# EAGLE design RAB FM Birds 3 for open bus (EAGLE 9.5.2)
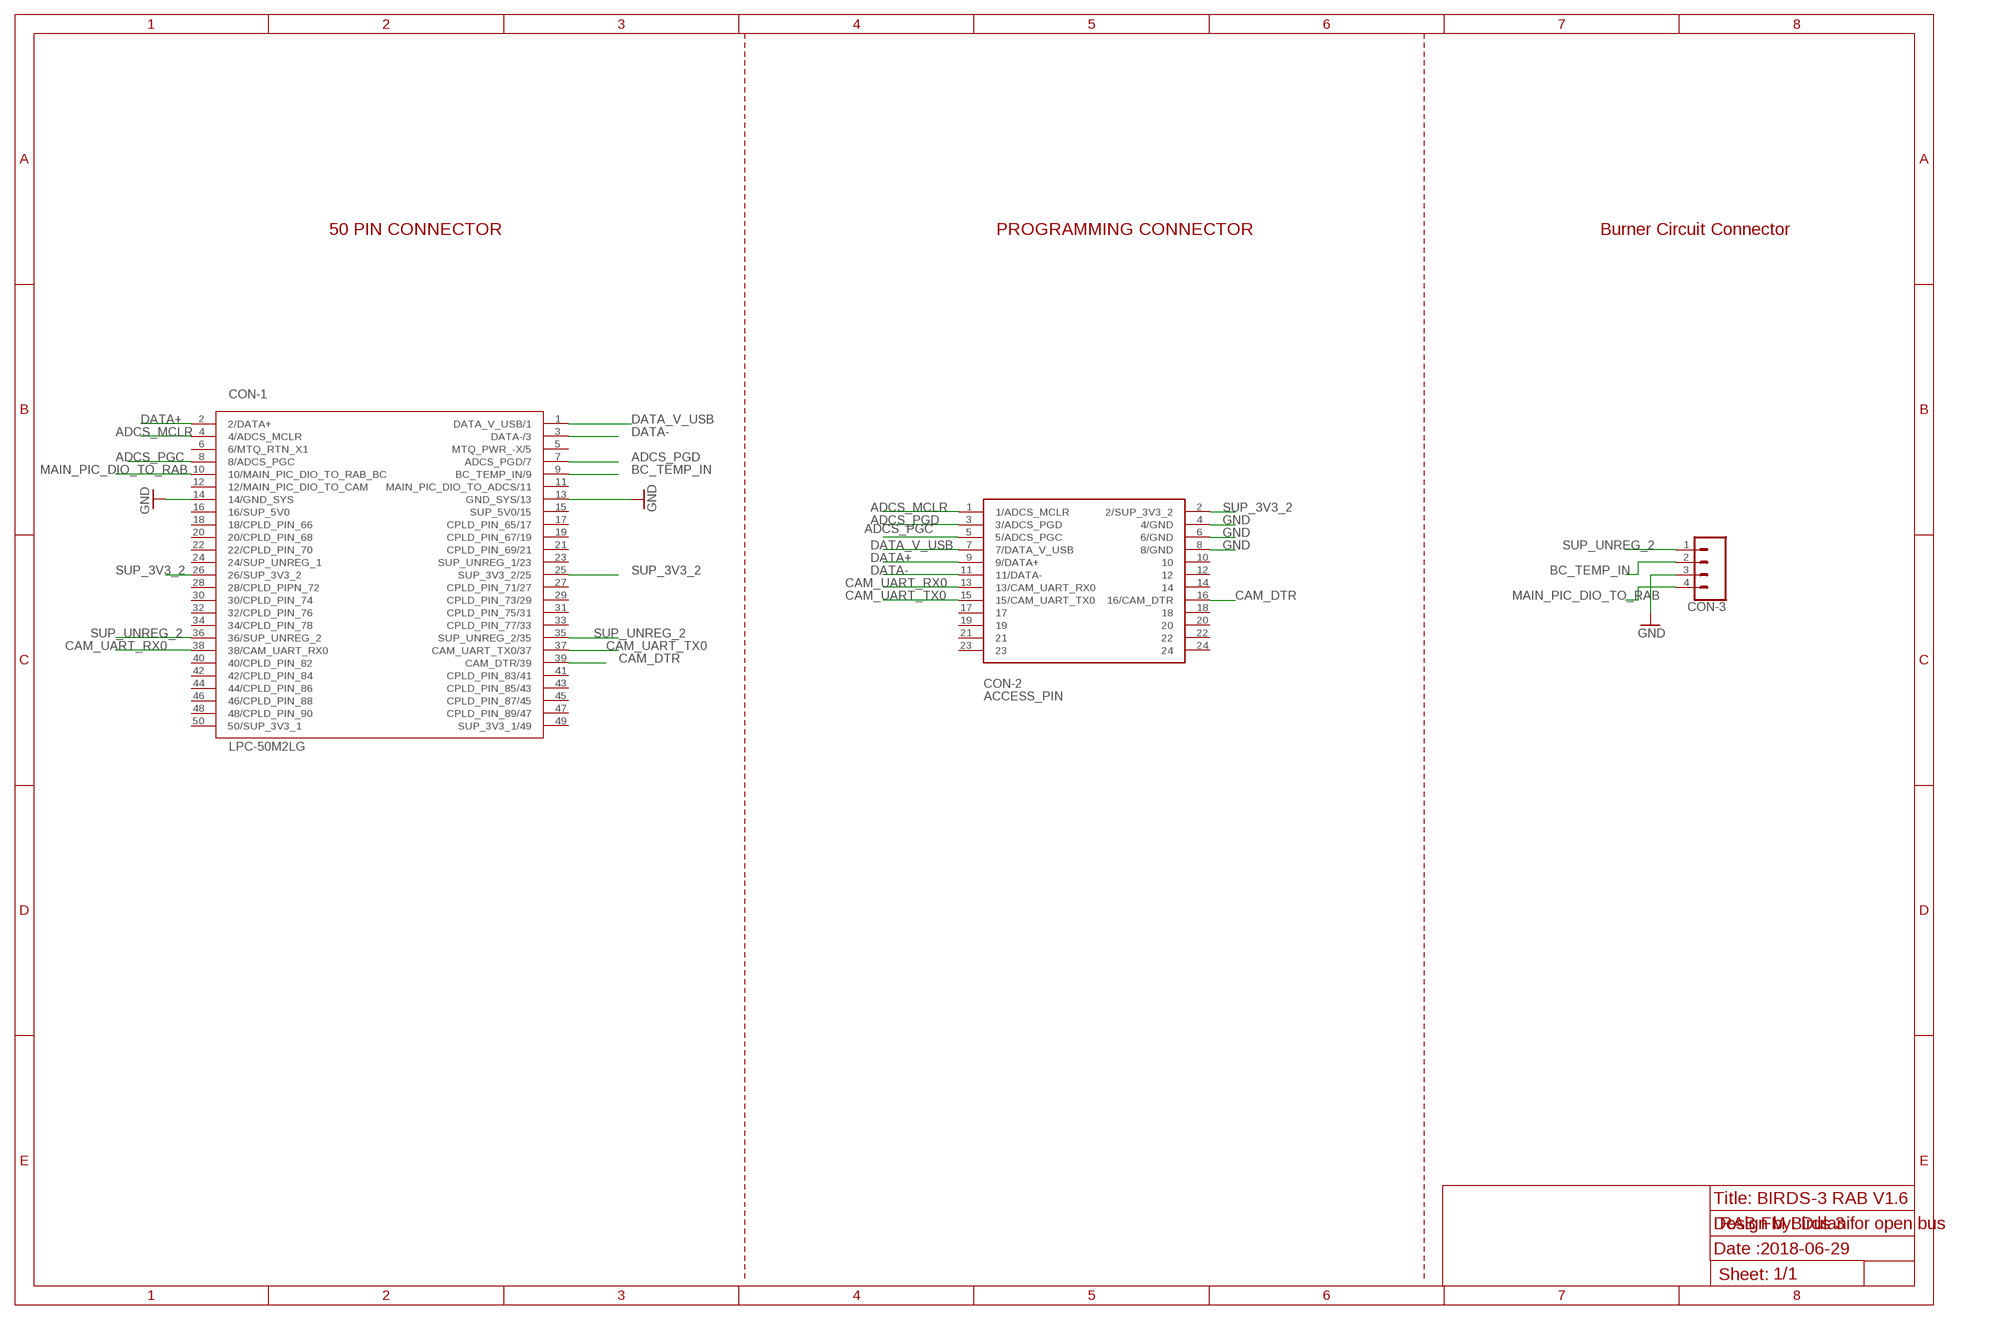
[diagram p0: schematic, sheet 1]

## Parts
CON-1  LPC-50M2LG  [LPC-50M2LG]
CON-2  ACCESS_PIN  [SMD24]
CON-3  CONN_04JST-PTH  [JST-4-PTH]

## Nets
ADCS_MCLR: CON-1.4(4/ADCS_MCLR) CON-2.1(1/ADCS_MCLR)
ADCS_PGC: CON-1.8(8/ADCS_PGC) CON-2.5(5/ADCS_PGC)
ADCS_PGD: CON-1.7(ADCS_PGD/7) CON-2.3(3/ADCS_PGD)
BC_TEMP_IN: CON-1.9(BC_TEMP_IN/9) CON-3.2
CAM_DTR: CON-1.39(CAM_DTR/39) CON-2.16(16/CAM_DTR)
CAM_UART_RX0: CON-1.38(38/CAM_UART_RX0) CON-2.13(13/CAM_UART_RX0)
CAM_UART_TX0: CON-1.37(CAM_UART_TX0/37) CON-2.15(15/CAM_UART_TX0)
DATA+: CON-1.2(2/DATA+) CON-2.9(9/DATA+)
DATA-: CON-1.3(DATA-/3) CON-2.11(11/DATA-)
DATA_V_USB: CON-1.1(DATA_V_USB/1) CON-2.7(7/DATA_V_USB)
GND: CON-1.13(GND_SYS/13) CON-1.14(14/GND_SYS) CON-2.4(4/GND) CON-2.6(6/GND) CON-2.8(8/GND) CON-3.3
MAIN_PIC_DIO_TO_RAB: CON-1.10(10/MAIN_PIC_DIO_TO_RAB_BC) CON-3.4
SUP_3V3_2: CON-1.25(SUP_3V3_2/25) CON-1.26(26/SUP_3V3_2) CON-2.2(2/SUP_3V3_2)
SUP_UNREG_2: CON-1.35(SUP_UNREG_2/35) CON-1.36(36/SUP_UNREG_2) CON-3.1
Unconnected: CON-1.5(MTQ_PWR_-X/5) CON-1.6(6/MTQ_RTN_X1) CON-1.11(MAIN_PIC_DIO_TO_ADCS/11) CON-1.12(12/MAIN_PIC_DIO_TO_CAM) CON-1.15(SUP_5V0/15) CON-1.16(16/SUP_5V0) CON-1.17(CPLD_PIN_65/17) CON-1.18(18/CPLD_PIN_66) CON-1.19(CPLD_PIN_67/19) CON-1.20(20/CPLD_PIN_68) CON-1.21(CPLD_PIN_69/21) CON-1.22(22/CPLD_PIN_70) CON-1.23(SUP_UNREG_1/23) CON-1.24(24/SUP_UNREG_1) CON-1.27(CPLD_PIN_71/27) CON-1.28(28/CPLD_PIPN_72) CON-1.29(CPLD_PIN_73/29) CON-1.30(30/CPLD_PIN_74) CON-1.31(CPLD_PIN_75/31) CON-1.32(32/CPLD_PIN_76) CON-1.33(CPLD_PIN_77/33) CON-1.34(34/CPLD_PIN_78) CON-1.40(40/CPLD_PIN_82) CON-1.41(CPLD_PIN_83/41) CON-1.42(42/CPLD_PIN_84) CON-1.43(CPLD_PIN_85/43) CON-1.44(44/CPLD_PIN_86) CON-1.45(CPLD_PIN_87/45) CON-1.46(46/CPLD_PIN_88) CON-1.47(CPLD_PIN_89/47) CON-1.48(48/CPLD_PIN_90) CON-1.49(SUP_3V3_1/49) CON-1.50(50/SUP_3V3_1) CON-2.10 CON-2.12 CON-2.14 CON-2.17 CON-2.18 CON-2.19 CON-2.20 CON-2.21 CON-2.22 CON-2.23 CON-2.24

## Notes on the sheet
- 50 PIN CONNECTOR | PROGRAMMING CONNECTOR | Burner Circuit Connector
- Title: BIRDS-3 RAB V1.6
- Design by: Dulani
- Date :2018-06-29

## Library data of the parts
CON-1 = BIRDS3_Tha_lib:LPC-50M2LG
CON-2 = Access_pin:ACCESS_PIN
CON-3 = SparkFun-Connectors:CONN_04: Multi connection point. Often used as Generic Header-pin footprint for 0.1 inch spaced/style header connections On any of the 0.1 inch spaced packages, you can populate with these: Break Away Headers - Straight <https://www.sparkfun.com/products/116> (PRT-00116) Break Away Male Headers - Right Angle <https://www.sparkfun.com/products/553> (PRT-00553) Female Headers <https://www.sparkfun.com/products/115> (PRT-00115) Break Away Headers - Machine Pin <https://www.sparkfun.com/products/117> (PRT-00117) Break Away Female Headers - Swiss Machine Pin <https://www.sparkfun.com/products/743> (PRT-00743) For SCREWTERMINALS and SPRING TERMINALS visit here: Screw Terimnals on SparkFun.com <https://www.sparkfun.com/search/results?term=Screw+Terminals> (5mm/3.5mm/2.54mm spacing) This device is also useful as a general connection point to wire up your design to another part of your project. Our various solder wires solder well into these plated through hole pads. Hook-Up Wire - Assortment (Stranded, 22 AWG) <https://www.sparkfun.com/products/11375> (PRT-11375) Hook-Up Wire - Assortment (Solid Core, 22 AWG) <https://www.sparkfun.com/products/11367> (PRT-11367) View the entire wire category on our website here <https://www.sparkfun.com/categories/141> Special notes: Molex polarized connector foot print use with SKU : PRT-08231 with associated crimp pins and housings. 1MM SMD Version SKU: PRT-10208; PROD_ID: WIRE-13531; SF_ID: PRT-09916

## Board
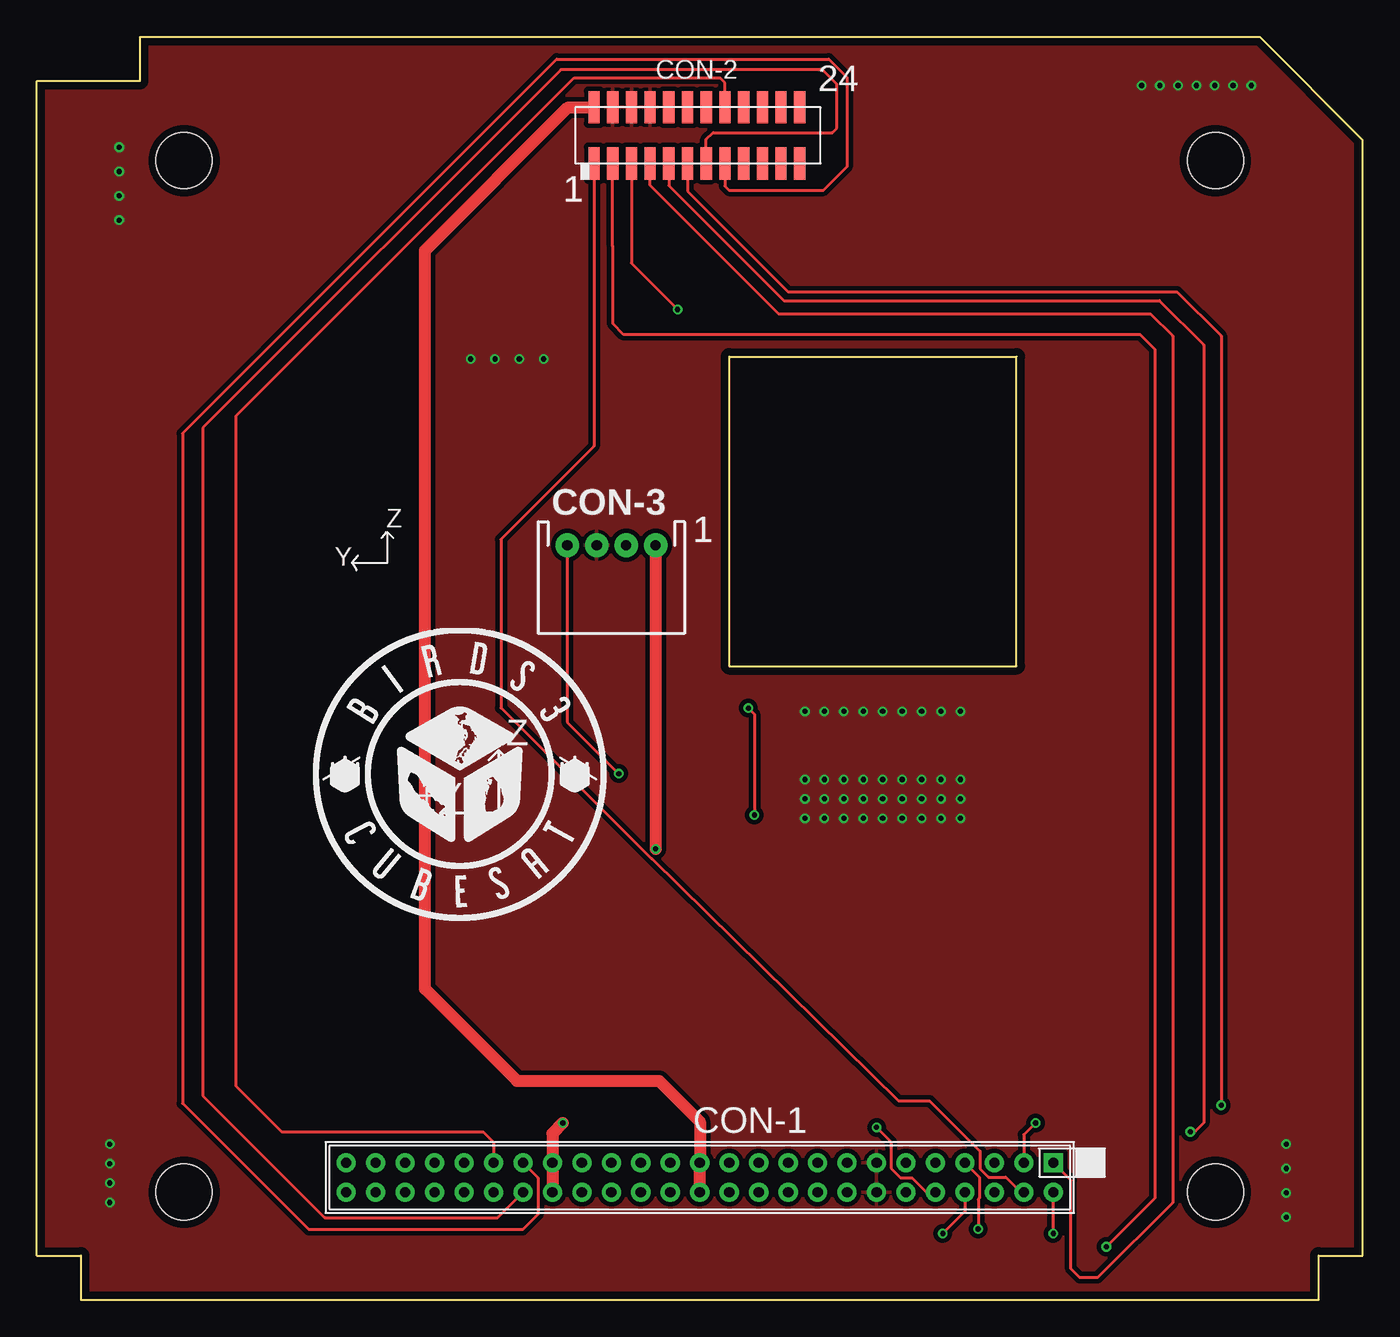
[diagram p1: board, top side]
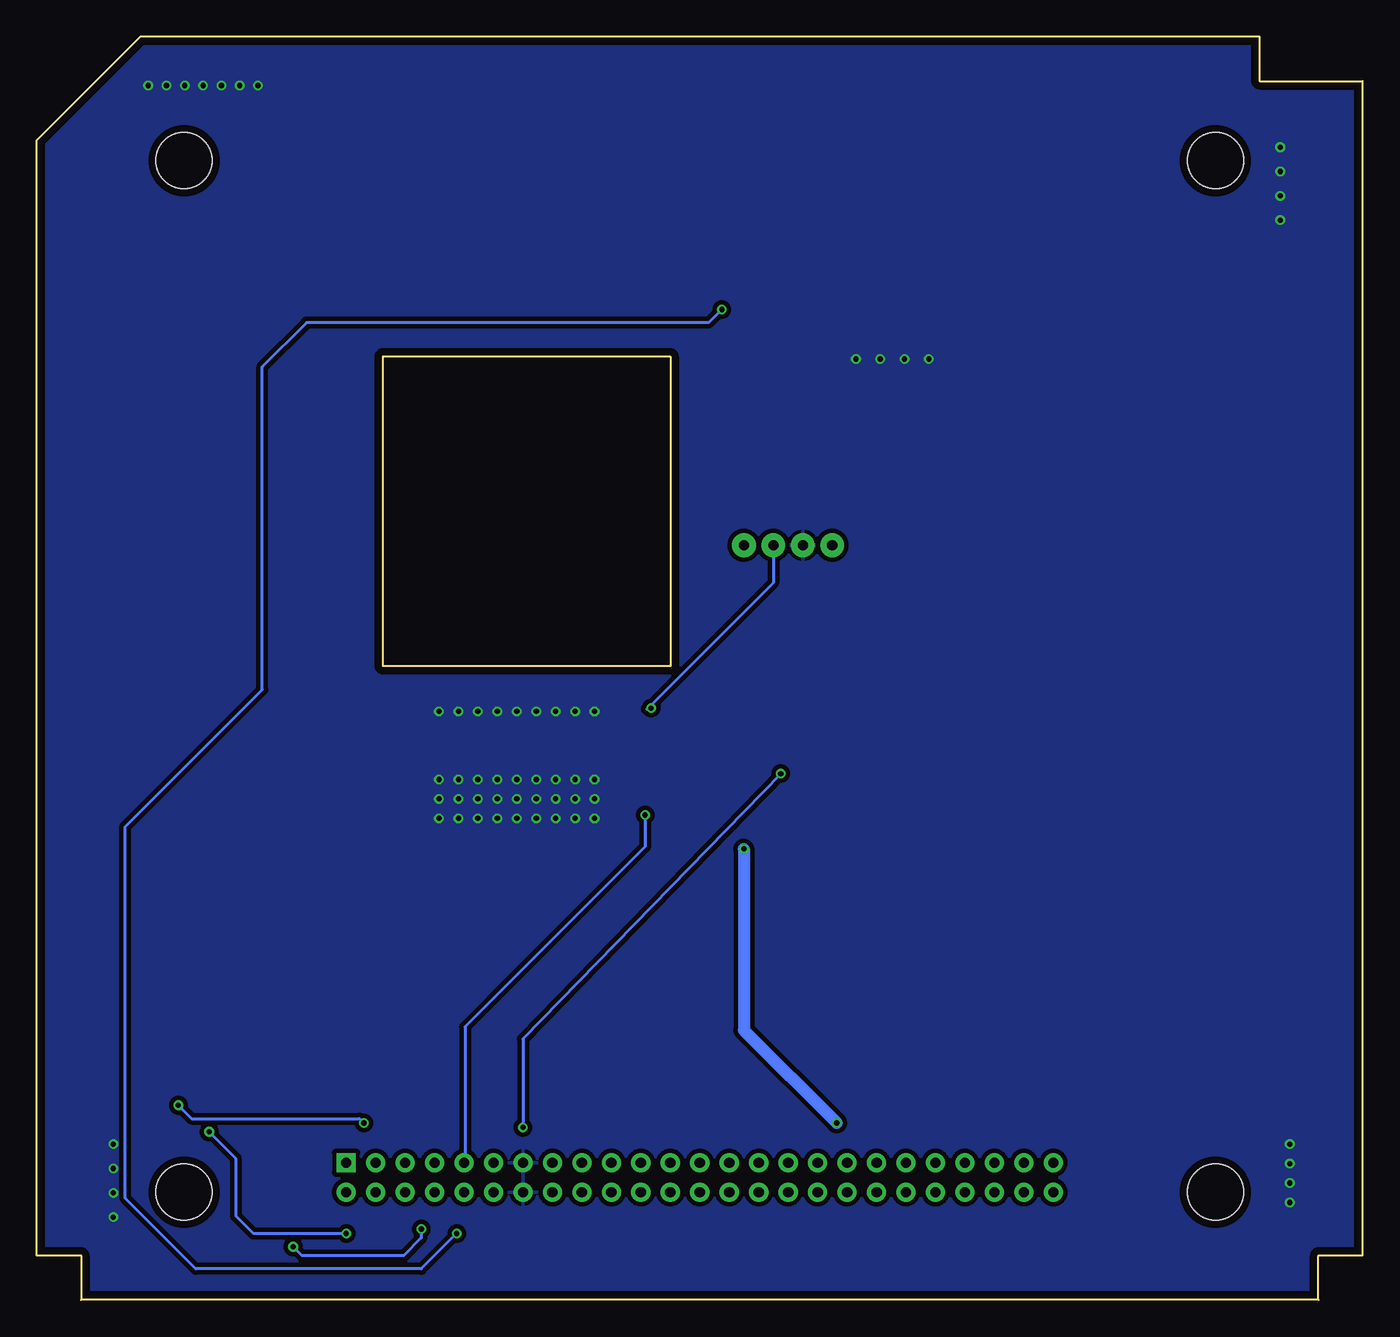
[diagram p2: board, bottom side, seen from below]

Size 90 x 85.7 mm. Coordinates in mm from the lower left corner, seen from the top.
Outline: 3,0 87,0 87,3 90,3 90,78.7 83,85.7 7,85.7 7,82.7 0,82.7 0,3 3,3 3,0
Outline: 47,64 66.5,64 66.5,43 47,43 47,64
Copper layers (1+2*15+16): Top 0.018mm / dielectric 0.25mm / Route2 0.035mm / dielectric 1mm / Route15 0.035mm / dielectric 0.25mm / Bottom 0.018mm
Design rules "pban_5mil-l4": minimum track width 5mil, minimum drill 0.3mm, track to track 5mil, track to pad 0.229mm, pad to pad 5mil, via to via 5mil, smd to smd 5mil, copper to edge 0.5mm, drill to drill 0.5mm, minimum pad ring 0.15mm, minimum via ring 0.15mm, stop-mask expansion 4mil, vias tented up to drill 0.35mm, thermal gap 10mil
Holes 3.8 mm at 10,7.3 80,7.3 10,77.3 80,77.3

### Footprints (pad centres in the part's own frame; a part is rotated, then mirrored left to right if it is on the bottom)
LPC-50M2LG = drill 0.7 pad 1.3 square: 1 0,2 | drill 0.7 pad 1.3: 2 0,0; 3 2,2; 4 2,0; 5 4,2; 6 4,0; 7 6,2; 8 6,0; 9 8,2; 10 8,0; 11 10,2; 12 10,0; 13 12,2; 14 12,0; 15 14,2; 16 14,0; 17 16,2; 18 16,0; 19 18,2; 20 18,0; 21 20,2; 22 20,0; 23 22,2; 24 22,0; 25 24,2; 26 24,0; 27 26,2; 28 26,0; 29 28,2; 30 28,0; 31 30,2; 32 30,0; 33 32,2; 34 32,0; 35 34,2; 36 34,0; 37 36,2; 38 36,0; 39 38,2; 40 38,0; 41 40,2; 42 40,0; 43 42,2; 44 42,0; 45 44,2; 46 44,0; 47 46,2; 48 46,0; 49 48,2; 50 48,0
SMD24 = smd 2.2 x 0.76: 1 -3.81,-1.27; 2 0,-1.27; 3 -3.81,-2.54; 4 0,-2.54; 5 -3.81,-3.81; 6 0,-3.81; 7 -3.81,-5.08; 8 0,-5.08; 9 -3.81,-6.35; 10 0,-6.35; 11 -3.81,-7.62; 12 0,-7.62; 13 -3.81,-8.89; 14 0,-8.89; 15 -3.81,-10.16; 16 0,-10.16; 17 -3.81,-11.43; 18 0,-11.43; 19 -3.81,-12.7; 20 0,-12.7; 21 -3.81,-13.97; 22 0,-13.97; 23 -3.81,-15.24; 24 0,-15.24
JST-4-PTH = drill 0.7 pad 1.6: 1 -3,0; 2 -1,0; 3 1,0; 4 3,0

### Placement (x,y rotation side)
CON-1  69,7.3 0 bottom
CON-2  36.55,80.92 90 top
CON-3  39,51.2 180 top

### Tracks (layer width: path | path; a pad name or v marks a point on that pad's centre or on a via)
ADCS_MCLR
  Top 0.203: CON-2.1 37.82,57.92 31.5,51.6 31.5,40.17 41.73,29.94 41.76,29.94 58.5,13.5 60.6,13.5 64.02,10.08 64.02,8.89 64.59,8.32 65.78,8.32 66.8,7.3 CON-1.4
ADCS_PGC  (via drill 0.35)
  Top 0.203: CON-1.8 63,6 v61.5,4.5 | v43.5,67.2 40.36,70.34 CON-2.5 40.36,77.24
  Bottom 0.203: v61.5,4.5 63.9,2.1 79.2,2.1 84,6.9 84,32.1 74.7,41.4 74.7,63.3 71.7,66.3 44.4,66.3 v43.5,67.2
ADCS_PGD  (via drill 0.35)
  Top 0.152: 39.09,76.7 CON-2.3
  Top 0.203: v72.6,3.6 75.9,6.9 75.9,64.5 74.9,65.5 39.84,65.5 39.1,66.24 39.1,71.49 39.09,71.5 39.09,76.7 | v63.9,4.8 63.9,6.81 63.98,6.89 63.98,8.32 CON-1.7
  Bottom 0.203: v63.9,4.8 63.9,4.2 65.1,3 72,3 v72.6,3.6
BC_TEMP_IN  (via drill 0.35)
  Top 0.203: v48.3,40.15 48.71,39.74 v48.71,32.9
  Bottom 0.203: CON-3.2 40,48.66 48.58,40.08 48.37,40.08 v48.3,40.15 | v48.71,32.9 48.71,30.75 60.94,18.52 60.94,9.36 CON-1.9
CAM_DTR
  Top 0.203: CON-1.39 31,10.7 30.3,11.4 16.62,11.4 13.5,14.52 13.5,59.95 36.47,82.92 46.37,82.92 46.71,82.58 CON-2.16
CAM_UART_RX0
  Top 0.203: CON-2.13 45.44,78.74 45.9,79.2 54,79.2 54.3,79.5 54.3,82.5 53.32,83.48 35.57,83.48 11.26,59.17 11.26,13.86 19.54,5.58 31.28,5.58 CON-1.38
CAM_UART_TX0
  Top 0.203: CON-2.15 46.71,75.57 46.98,75.3 53.4,75.3 54.98,76.88 54.98,82.96 53.76,84.18 35.28,84.18 9.9,58.8 9.9,13.33 18.46,4.77 33,4.77 34.02,5.79 34.02,8.28 CON-1.37
DATA+  (via drill 0.35)
  Top 0.203: CON-2.9 42.9,75.6 50.7,67.8 76.2,67.8 79.2,64.8 79.2,12 78.6,11.4 v78.3,11.4 | v69,4.5 CON-1.2
  Bottom 0.203: v78.3,11.4 76.5,9.6 76.5,5.7 75.3,4.5 v69,4.5
DATA-  (via drill 0.35)
  Top 0.203: v80.4,13.2 80.4,65.4 77.4,68.4 51,68.4 44.17,75.23 CON-2.11 | v67.8,12 67,11.2 CON-1.3
  Bottom 0.203: v80.4,13.2 79.5,12.3 68.1,12.3 v67.8,12
DATA_V_USB
  Top 0.203: CON-2.7 41.63,75.62 50.35,66.9 75.6,66.9 77.1,65.4 77.1,6.6 72,1.5 70.8,1.5 70.2,2.1 70.2,8.1 CON-1.1
GND  (via drill 0.35)
  other vias: 52.14,33.99 53.46,33.99 54.78,33.99 56.1,33.99 57.42,33.99 58.74,33.99 60.06,33.99 61.38,33.99 52.14,32.67 53.46,32.67 54.78,32.67 56.1,32.67 57.42,32.67 58.74,32.67 60.06,32.67 61.38,32.67 52.14,35.31 53.46,35.31 54.78,35.31 56.1,35.31 57.42,35.31 58.74,35.31 60.06,35.31 61.38,35.31 52.14,39.93 53.46,39.93 54.78,39.93 56.1,39.93 57.42,39.93 58.74,39.93 60.06,39.93 61.38,39.93 62.7,39.93 62.7,35.31 62.7,33.99 62.7,32.67 74.99,82.4 5.59,78.21 5.59,76.56 5.59,74.91 5.59,73.26 29.45,63.84 31.1,63.84 32.75,63.84 34.4,63.84 4.95,9.24 4.95,7.92 4.95,6.6 4.95,10.56 84.81,10.56 84.81,8.91 84.81,7.26 84.81,5.61 76.23,82.4 77.47,82.4 78.72,82.4 79.96,82.4 81.2,82.4 82.44,82.4
  pour Top (isolate 0.305): -2.97,85.14 -2.97,1.98 0.99,-1.98 91.41,-1.98 92.73,-0.66 92.73,87.12 91.74,88.11 0,88.11
  pour Bottom (isolate 0.305): -4.62,85.8 -1.32,89.1 94.05,89.1 94.71,88.44 94.71,83.82 94.71,-2.31 93.39,-3.63 0,-3.63 -5.28,1.65 -5.28,85.14
MAIN_PIC_DIO_TO_RAB  (via drill 0.35)
  Top 0.203: v57,11.7 57.98,10.72 57.98,8.93 58.63,8.28 59.41,8.28 60.39,7.3 CON-1.10 | CON-3.4 36,39.2 v39.5,35.7
  Bottom 0.203: v39.5,35.7 57,17.7 v57,11.7
SUP_3V3_2
  Top 0.813: CON-1.26 CON-1.25 45,12.09 42.24,14.85 32.59,14.85 26.34,21.1 26.34,71.2 36.06,80.92 CON-2.2
SUP_UNREG_2  (via drill 0.35)
  Top 0.813: CON-3.1 v42,30.6 | CON-1.36 CON-1.35 35,11.3 v35.7,12
  Bottom 0.813: v42,30.6 42,18.3 v35.7,12

### Text on the board
tPlace: Z | Y
tNames: 24 | 1 | 1 | +Z | +Y